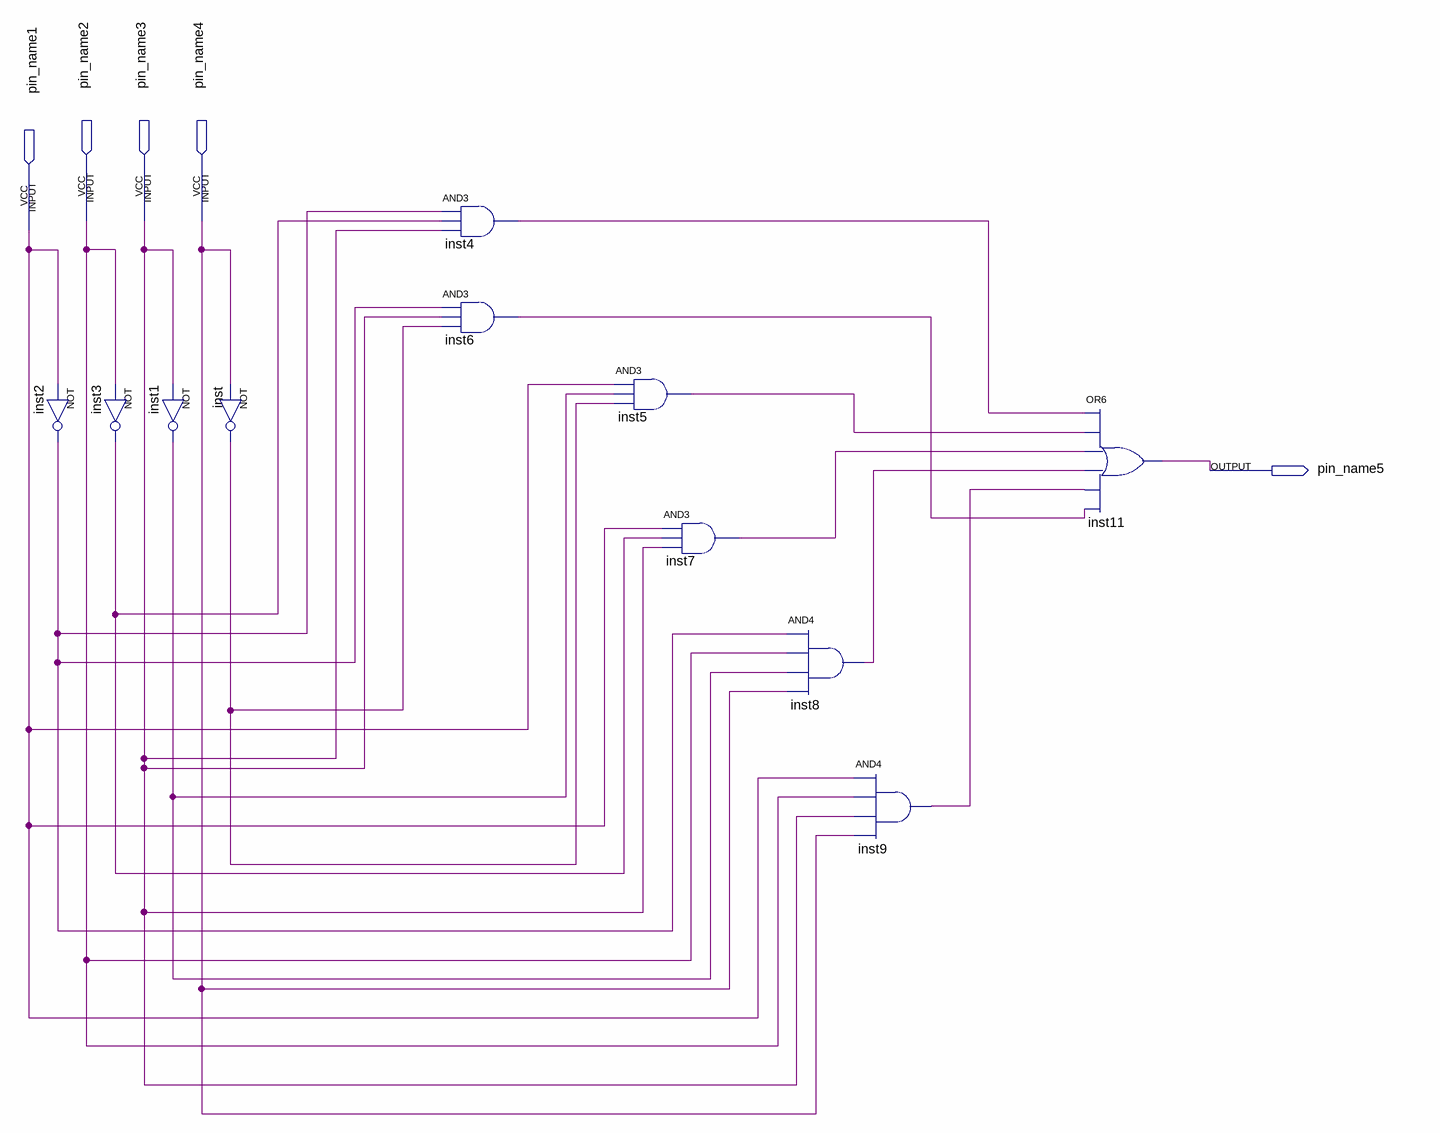
[diagram p0: schematic sheet]
// Quartus schematic c1.bdf as structural Verilog: 11 symbols, 5 pins
module c1 (
  input  pin_name2,
  input  pin_name3,
  input  pin_name4,
  input  pin_name1,
  output pin_name5
);

  wire inst1_out, inst2_out, inst3_out, inst4_out, inst5_out, inst6_out, inst7_out, inst8_out, inst9_out,
       inst_out;

  not inst2 (inst2_out, pin_name1);
  not inst1 (inst1_out, pin_name3);
  not inst3 (inst3_out, pin_name2);
  not inst (inst_out, pin_name4);
  and inst4 (inst4_out, inst2_out, inst3_out, pin_name3);
  and inst6 (inst6_out, inst2_out, pin_name3, inst_out);
  and inst5 (inst5_out, pin_name1, inst1_out, inst_out);
  and inst7 (inst7_out, pin_name1, inst3_out, pin_name3);
  and inst8 (inst8_out, inst2_out, pin_name2, inst1_out, pin_name4);
  and inst9 (inst9_out, pin_name1, pin_name2, pin_name3, pin_name4);
  or inst11 (pin_name5, inst4_out, inst5_out, inst7_out, inst8_out, inst9_out, inst6_out);
endmodule
